# Altium schematic sheet fpga-bank3-inside.SchDoc: FPGA - Bank 3
size Letter; CheckedBy: E. Chiu; CompanyName: Brinton Engineering, LLC; DrawnBy: J. Brinton; Engineer: J. Brinton; Address1: 3479 Edison Way; Address2: Menlo Park CA 94025; Address3: +1 (877) 778-8435; Address4: brintonengineering.com; Revision: 1; SheetNumber: 23; SheetTotal: 60
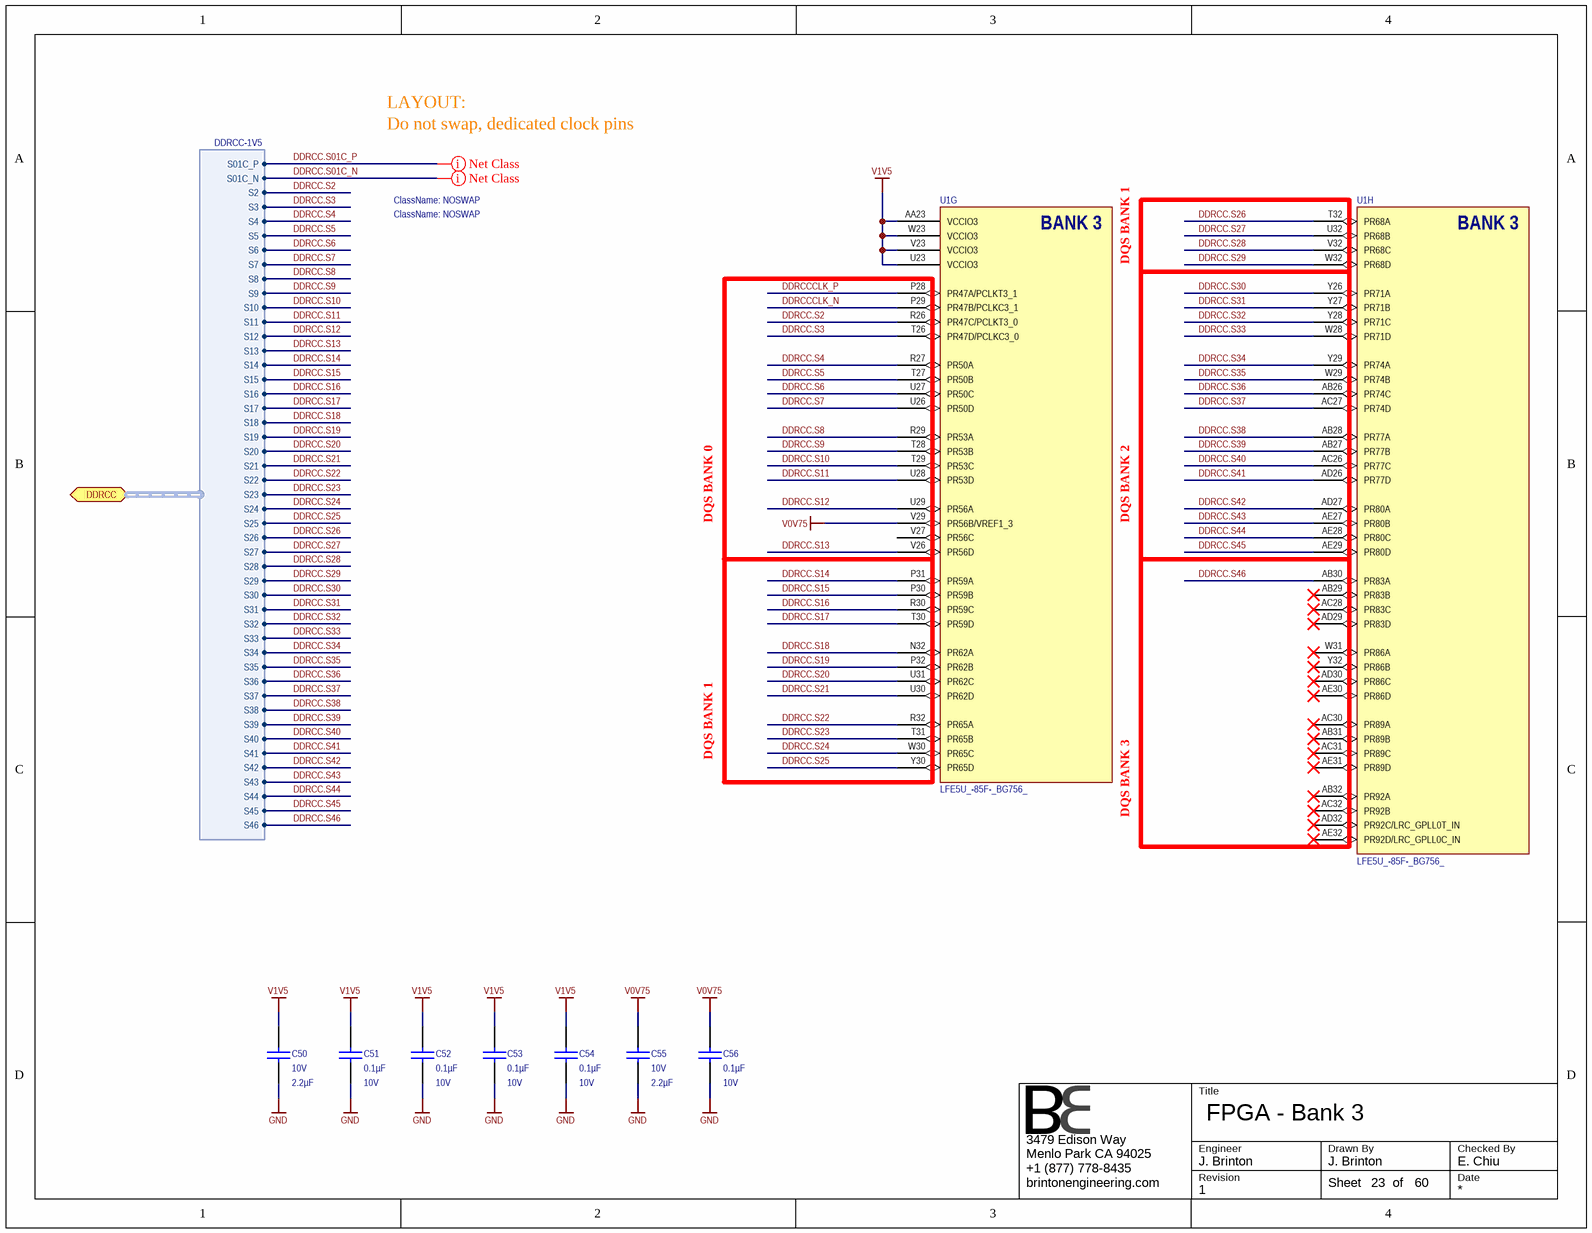
[diagram p0: fpga-bank3-inside.SchDoc]

## Parts
C50  Voltage - Rated: 10V  Capacitance: 2.2µF  [CAPC1608X90N]  (hidden comment: GRM188R71A225KE15D)
C51  Capacitance: 0.1µF  Voltage - Rated: 10V  [CAPC1005X56N]  (hidden comment: GRM155R71A104KA01J)
C52  Capacitance: 0.1µF  Voltage - Rated: 10V  [CAPC1005X56N]  (hidden comment: GRM155R71A104KA01J)
C53  Capacitance: 0.1µF  Voltage - Rated: 10V  [CAPC1005X56N]  (hidden comment: GRM155R71A104KA01J)
C54  Capacitance: 0.1µF  Voltage - Rated: 10V  [CAPC1005X56N]  (hidden comment: GRM155R71A104KA01J)
C55  Voltage - Rated: 10V  Capacitance: 2.2µF  [CAPC1608X90N]  (hidden comment: GRM188R71A225KE15D)
C56  Capacitance: 0.1µF  Voltage - Rated: 10V  [CAPC1005X56N]  (hidden comment: GRM155R71A104KA01J)
U1  LFE5U_-85F-_BG756_  [caBGA756]  (parts G,H of 19)

## Ports
DDRCC (harness DDRCC-1V5)

## Harnesses
DDRCC-1V5: S01C_P, S01C_N, S2, S3, S4, S5, S6, S7, S8, S9, S10, S11, S12, S13, S14, S15, S16, S17, S18, S19, S20, S21, S22, S23, S24, S25, S26, S27, S28, S29, S30, S31, S32, S33, S34, S35, S36, S37, S38, S39, S40, S41, S42, S43, S44, S45, S46

## Nets
GND: C50.1 C51.1 C52.1 C53.1 C54.1 C55.1 C56.1
V0V75: C55.2 C56.2 U1.V29(PR56B/VREF1_3)
V1V5: C50.2 C51.2 C52.2 C53.2 C54.2 U1.AA23(VCCIO3) U1.U23(VCCIO3) U1.V23(VCCIO3) U1.W23(VCCIO3)
DDRCC.S01C_N: port DDRCC.S01C_N
DDRCC.S01C_P: port DDRCC.S01C_P
DDRCC.S2: U1.R26(PR47C/PCLKT3_0) ; port DDRCC.S2
DDRCC.S3: U1.T26(PR47D/PCLKC3_0) ; port DDRCC.S3
DDRCC.S4: U1.R27(PR50A) ; port DDRCC.S4
DDRCC.S5: U1.T27(PR50B) ; port DDRCC.S5
DDRCC.S6: U1.U27(PR50C) ; port DDRCC.S6
DDRCC.S7: U1.U26(PR50D) ; port DDRCC.S7
DDRCC.S8: U1.R29(PR53A) ; port DDRCC.S8
DDRCC.S9: U1.T28(PR53B) ; port DDRCC.S9
DDRCC.S10: U1.T29(PR53C) ; port DDRCC.S10
DDRCC.S11: U1.U28(PR53D) ; port DDRCC.S11
DDRCC.S12: U1.U29(PR56A) ; port DDRCC.S12
DDRCC.S13: U1.V26(PR56D) ; port DDRCC.S13
DDRCC.S14: U1.P31(PR59A) ; port DDRCC.S14
DDRCC.S15: U1.P30(PR59B) ; port DDRCC.S15
DDRCC.S16: U1.R30(PR59C) ; port DDRCC.S16
DDRCC.S17: U1.T30(PR59D) ; port DDRCC.S17
DDRCC.S18: U1.N32(PR62A) ; port DDRCC.S18
DDRCC.S19: U1.P32(PR62B) ; port DDRCC.S19
DDRCC.S20: U1.U31(PR62C) ; port DDRCC.S20
DDRCC.S21: U1.U30(PR62D) ; port DDRCC.S21
DDRCC.S22: U1.R32(PR65A) ; port DDRCC.S22
DDRCC.S23: U1.T31(PR65B) ; port DDRCC.S23
DDRCC.S24: U1.W30(PR65C) ; port DDRCC.S24
DDRCC.S25: U1.Y30(PR65D) ; port DDRCC.S25
DDRCC.S26: U1.T32(PR68A) ; port DDRCC.S26
DDRCC.S27: U1.U32(PR68B) ; port DDRCC.S27
DDRCC.S28: U1.V32(PR68C) ; port DDRCC.S28
DDRCC.S29: U1.W32(PR68D) ; port DDRCC.S29
DDRCC.S30: U1.Y26(PR71A) ; port DDRCC.S30
DDRCC.S31: U1.Y27(PR71B) ; port DDRCC.S31
DDRCC.S32: U1.Y28(PR71C) ; port DDRCC.S32
DDRCC.S33: U1.W28(PR71D) ; port DDRCC.S33
DDRCC.S34: U1.Y29(PR74A) ; port DDRCC.S34
DDRCC.S35: U1.W29(PR74B) ; port DDRCC.S35
DDRCC.S36: U1.AB26(PR74C) ; port DDRCC.S36
DDRCC.S37: U1.AC27(PR74D) ; port DDRCC.S37
DDRCC.S38: U1.AB28(PR77A) ; port DDRCC.S38
DDRCC.S39: U1.AB27(PR77B) ; port DDRCC.S39
DDRCC.S40: U1.AC26(PR77C) ; port DDRCC.S40
DDRCC.S41: U1.AD26(PR77D) ; port DDRCC.S41
DDRCC.S42: U1.AD27(PR80A) ; port DDRCC.S42
DDRCC.S43: U1.AE27(PR80B) ; port DDRCC.S43
DDRCC.S44: U1.AE28(PR80C) ; port DDRCC.S44
DDRCC.S45: U1.AE29(PR80D) ; port DDRCC.S45
DDRCC.S46: U1.AB30(PR83A) ; port DDRCC.S46
DDRCCCLK_N: U1.P29(PR47B/PCLKC3_1)
DDRCCCLK_P: U1.P28(PR47A/PCLKT3_1)

Not connected (* = marked no-connect by the designer): U1 AB29(PR83B)* AB31(PR89B)* AB32(PR92A)* AC28(PR83C)* AC30(PR89A)* AC31(PR89C)* AC32(PR92B)* AD29(PR83D)* AD30(PR86C)* AD32(PR92C/LRC_GPLL0T_IN)* AE30(PR86D)* AE31(PR89D)* AE32(PR92D/LRC_GPLL0C_IN)* V27(PR56C) W31(PR86A)* Y32(PR86B)*

## Layout directives
net class NOSWAP: DDRCC.S01C_N, DDRCC.S01C_P

## Notes on the sheet
- LAYOUT:
- Do not swap, dedicated clock pins
- DQS BANK 1
- DQS BANK 0
- DQS BANK 2
- DQS BANK 3
- Title
- Engineer
- Revision
- Drawn By
- Checked By
- Date
- Sheet
- of
- (in symbol LFE5U_-85F-_BG756_, part G) BANK 3
- (in symbol LFE5U_-85F-_BG756_, part H) BANK 3

## Library data of the parts
C50 C55 = GRM188R71A225KE15D: CAP CER 2.2UF 10V 10% X7R 0603; Manufacturer: Murata Electronics North America; Manufacturer P/N: GRM188R71A225KE15D; Operating Temperature: -55°C ~ 125°C; Thickness (Max): 0.035" (0.90mm); Tolerance: ±10%; Package / Case: 0603 (1608 Metric); Temperature Coefficient: X7R; Supplier 1: Newark; Supplier 2: Digi-Key; RoHS: RoHS Compliant; Size / Dimension: 0.063" L x 0.031" W (1.60mm x 0.80mm); Mounting Type: Surface Mount, MLCC; ComponentLink1URL: http://www.murata.com/~/media/webrenewal/support/library/catalog/products/capacitor/mlcc/c02e.ashx; ComponentLink1Description: http://www.murata.com/~/media/webrenewal/support/library/catalog/products/capacitor/mlcc/c02e.ashx; Supplier Part Number 1: 72R4209; Supplier Part Number 2: 490-4520-1-ND
C51-C54 C56 = GRM155R71A104KA01J: CAP CER 0.1UF 10V 10% X7R 0402; Manufacturer: Murata Electronics North America; Manufacturer P/N: GRM155R71A104KA01J; Operating Temperature: -55°C ~ 125°C; Thickness (Max): 0.022" (0.55mm); Size / Dimension: 0.039" L x 0.020" W (1.00mm x 0.50mm); RoHS: RoHS Compliant; Mounting Type: Surface Mount, MLCC; Supplier 1: Digi-Key; ComponentLink1URL: http://www.murata.com/~/media/webrenewal/support/library/catalog/products/capacitor/mlcc/c02e.ashx; ComponentLink1Description: http://www.murata.com/~/media/webrenewal/support/library/catalog/products/capacitor/mlcc/c02e.ashx; Supplier Part Number 1: 490-6322-1-ND; Temperature Coefficient: X7R; Package / Case: 0402 (1005 Metric); Tolerance: ±10%
U1 = LFE5U_-85F-_BG756_: ECP5 FPGA, 85k LUT, 756-caBGA; Manufacturer: Lattice Semiconductor; Manufacturer P/N: LFE5U_-85F-_BG756_